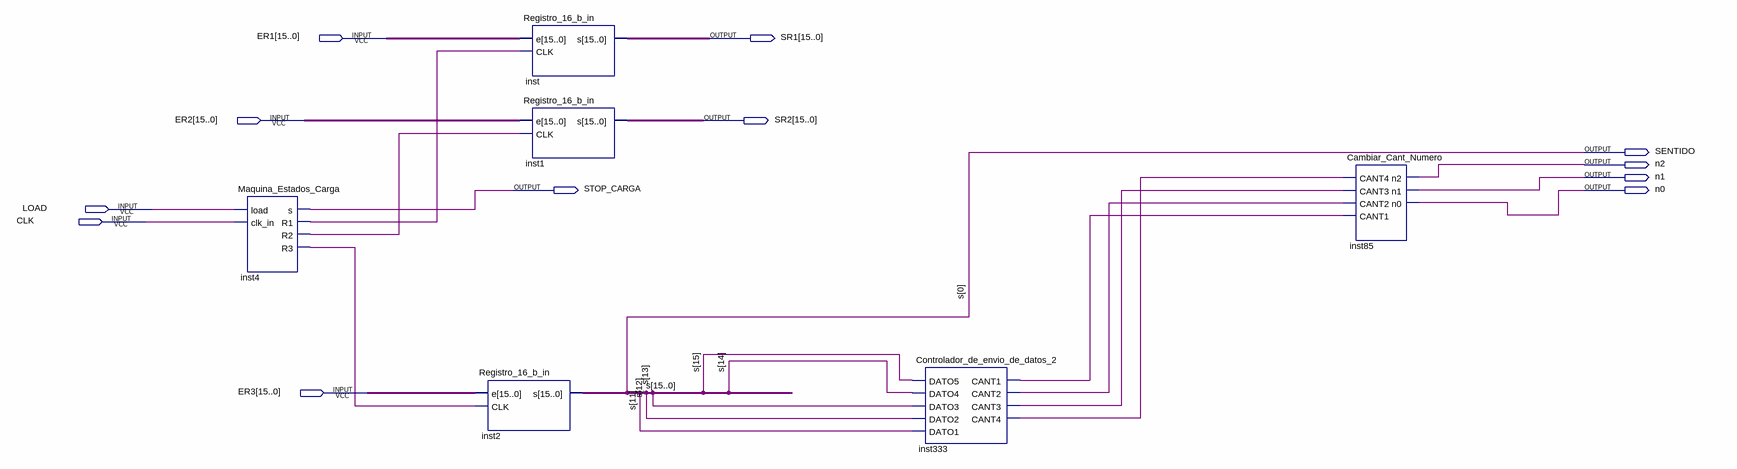
[diagram p0: schematic sheet]
// Quartus schematic Maquina_Estado_Y_Registro.bdf as structural Verilog: 6 symbols, 12 pins
module Maquina_Estado_Y_Registro (
  input  [15:0] ER1,
  input  [15:0] ER2,
  input  LOAD,
  input  CLK,
  input  [15:0] ER3,
  output [15:0] SR1,
  output [15:0] SR2,
  output SENTIDO,
  output n2,
  output n1,
  output STOP_CARGA,
  output n0
);

  wire inst4_r1, inst4_r2, inst4_r3, inst333_cant1, inst333_cant2, inst333_cant3, inst333_cant4;
  wire [15:1] s;

  Maquina_Estados_Carga inst4 (.load(LOAD), .clk_in(CLK), .s(STOP_CARGA), .R1(inst4_r1), .R2(inst4_r2), .R3(inst4_r3));
  Registro_16_b_in inst2 (.e(ER3), .CLK(inst4_r3), .s({s, SENTIDO}));
  Registro_16_b_in inst (.e(ER1), .CLK(inst4_r1), .s(SR1));
  Registro_16_b_in inst1 (.e(ER2), .CLK(inst4_r2), .s(SR2));
  Controlador_de_envio_de_datos_2 inst333 (
    .DATO5(s[15]), .DATO4(s[14]), .DATO3(s[13]), .DATO2(s[12]), .DATO1(s[11]), .CANT1(inst333_cant1),
    .CANT2(inst333_cant2), .CANT3(inst333_cant3), .CANT4(inst333_cant4));
  Cambiar_Cant_Numero inst85 (
    .CANT4(inst333_cant4), .CANT3(inst333_cant3), .CANT2(inst333_cant2), .CANT1(inst333_cant1), .n2(n2),
    .n1(n1), .n0(n0));

  // Other names for the same wires on the sheet: s[0] = SENTIDO
endmodule
